# Altium schematic sheet Rectifiers.SchDoc
size A
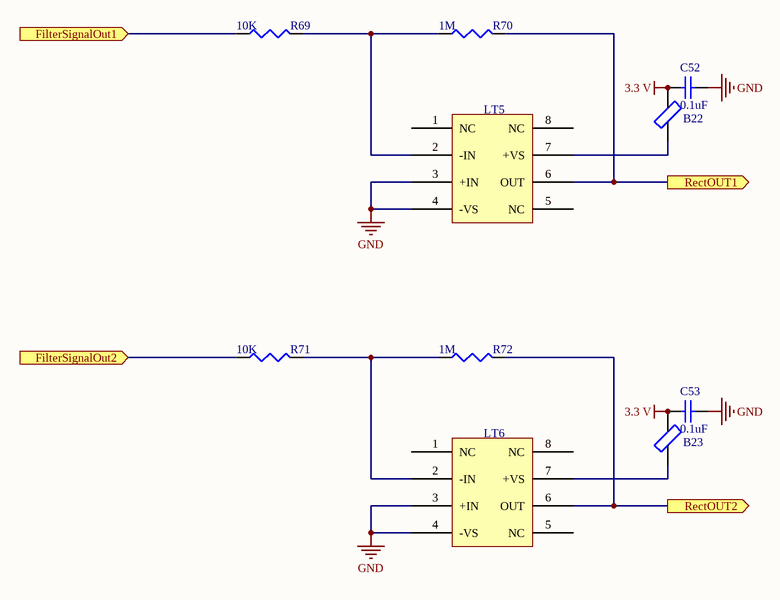
[diagram p0: Rectifiers.SchDoc]

## Parts
B22  Ferrite Bead  [Resistor 0603]  (value not drawn)
B23  Ferrite Bead  [Resistor 0603]  (value not drawn)
C52  value 0.1uF  [C1206]  (hidden comment: .1uF 20V Ceramic Low ESR)
C53  value 0.1uF  [C1206]  (hidden comment: .1uF 20V Ceramic Low ESR)
LT5  LT1677 SO8 Package  [SO8]  (value not drawn)
LT6  LT1677 SO8 Package  [SO8]  (value not drawn)
R69  value 10K  [Capacitor 0603]  (hidden comment: 1/16 118K watt 1%)
R70  value 1M  [Capacitor 0603]  (hidden comment: 1/16 118K watt 1%)
R71  value 10K  [Capacitor 0603]  (hidden comment: 1/16 118K watt 1%)
R72  value 1M  [Capacitor 0603]  (hidden comment: 1/16 118K watt 1%)

## Ports
FilterSignalOut1 (in), FilterSignalOut2 (in), RectOUT1 (out), RectOUT2 (out)

## Nets
3.3 V: B22.1 B23.1 C52.1 C53.1
GND: C52.2 C53.2 LT5.3(+IN) LT5.4(-VS) LT6.3(+IN) LT6.4(-VS)
FilterSignalOut1: R69.1 ; port FilterSignalOut1
FilterSignalOut2: R71.1 ; port FilterSignalOut2
RectOUT1: LT5.6(OUT) R70.2 ; port RectOUT1
RectOUT2: LT6.6(OUT) R72.2 ; port RectOUT2
NetB22_2: B22.2 LT5.7(+VS)
NetB23_2: B23.2 LT6.7(+VS)
NetLT5_2: LT5.2(-IN) R69.2 R70.1
NetLT6_2: LT6.2(-IN) R71.2 R72.1

Not connected (* = marked no-connect by the designer): LT5 1(NC) 5(NC) 8(NC); LT6 1(NC) 5(NC) 8(NC)

## Library data of the parts
B22 B23 = Ferrite Bead: Ferrite Bead: 200 Ohm @ 25 Mhz
C52 C53 = Cap Semi: Capacitor (Semiconductor SIM Model); Published: 8-Jun-2000; LatestRevisionDate: 29-May-2009; LatestRevisionNote: IPC-7351 Footprint Added.; PackageReference: C1206; Publisher: Altium Limited; PackageDescription: Chip Capacitor
LT5 LT6 = LT1677
R69-R72 = Res3: Resistor; Published: 8-Jun-2000; LatestRevisionDate: 29-May-2009; LatestRevisionNote: IPC-7351 Footprint Added.; PackageReference: J1-0603; Publisher: Altium Limited; PackageDescription: Chip Resistor